# Altium schematic sheet CR-10 Motherboard_1.SchDoc: Sheet Description
size A3; Organization: Organization; Address1: Address1; Address2: Address2; Address3: Address3; Address4: Address4; DocumentNumber: 1; Revision: 0; SheetNumber: 1; SheetTotal: 2; PageSetup: Record=PageOptions|CenterHorizontal=True|CenterVertical=True|PrintScale=1.00|XCorrection=1.00|YCorrection=1.00|PrintKind=1|BorderSize=5000000|LeftOffset=0|BottomOffset=0|Orientation=2|PaperLength=1000|PaperWidth=1000|Scale=100|PaperSource=7|PrintQuality=-4|MediaType=1|DitherType=10|PaperKind=A3|PrintScaleMode=0
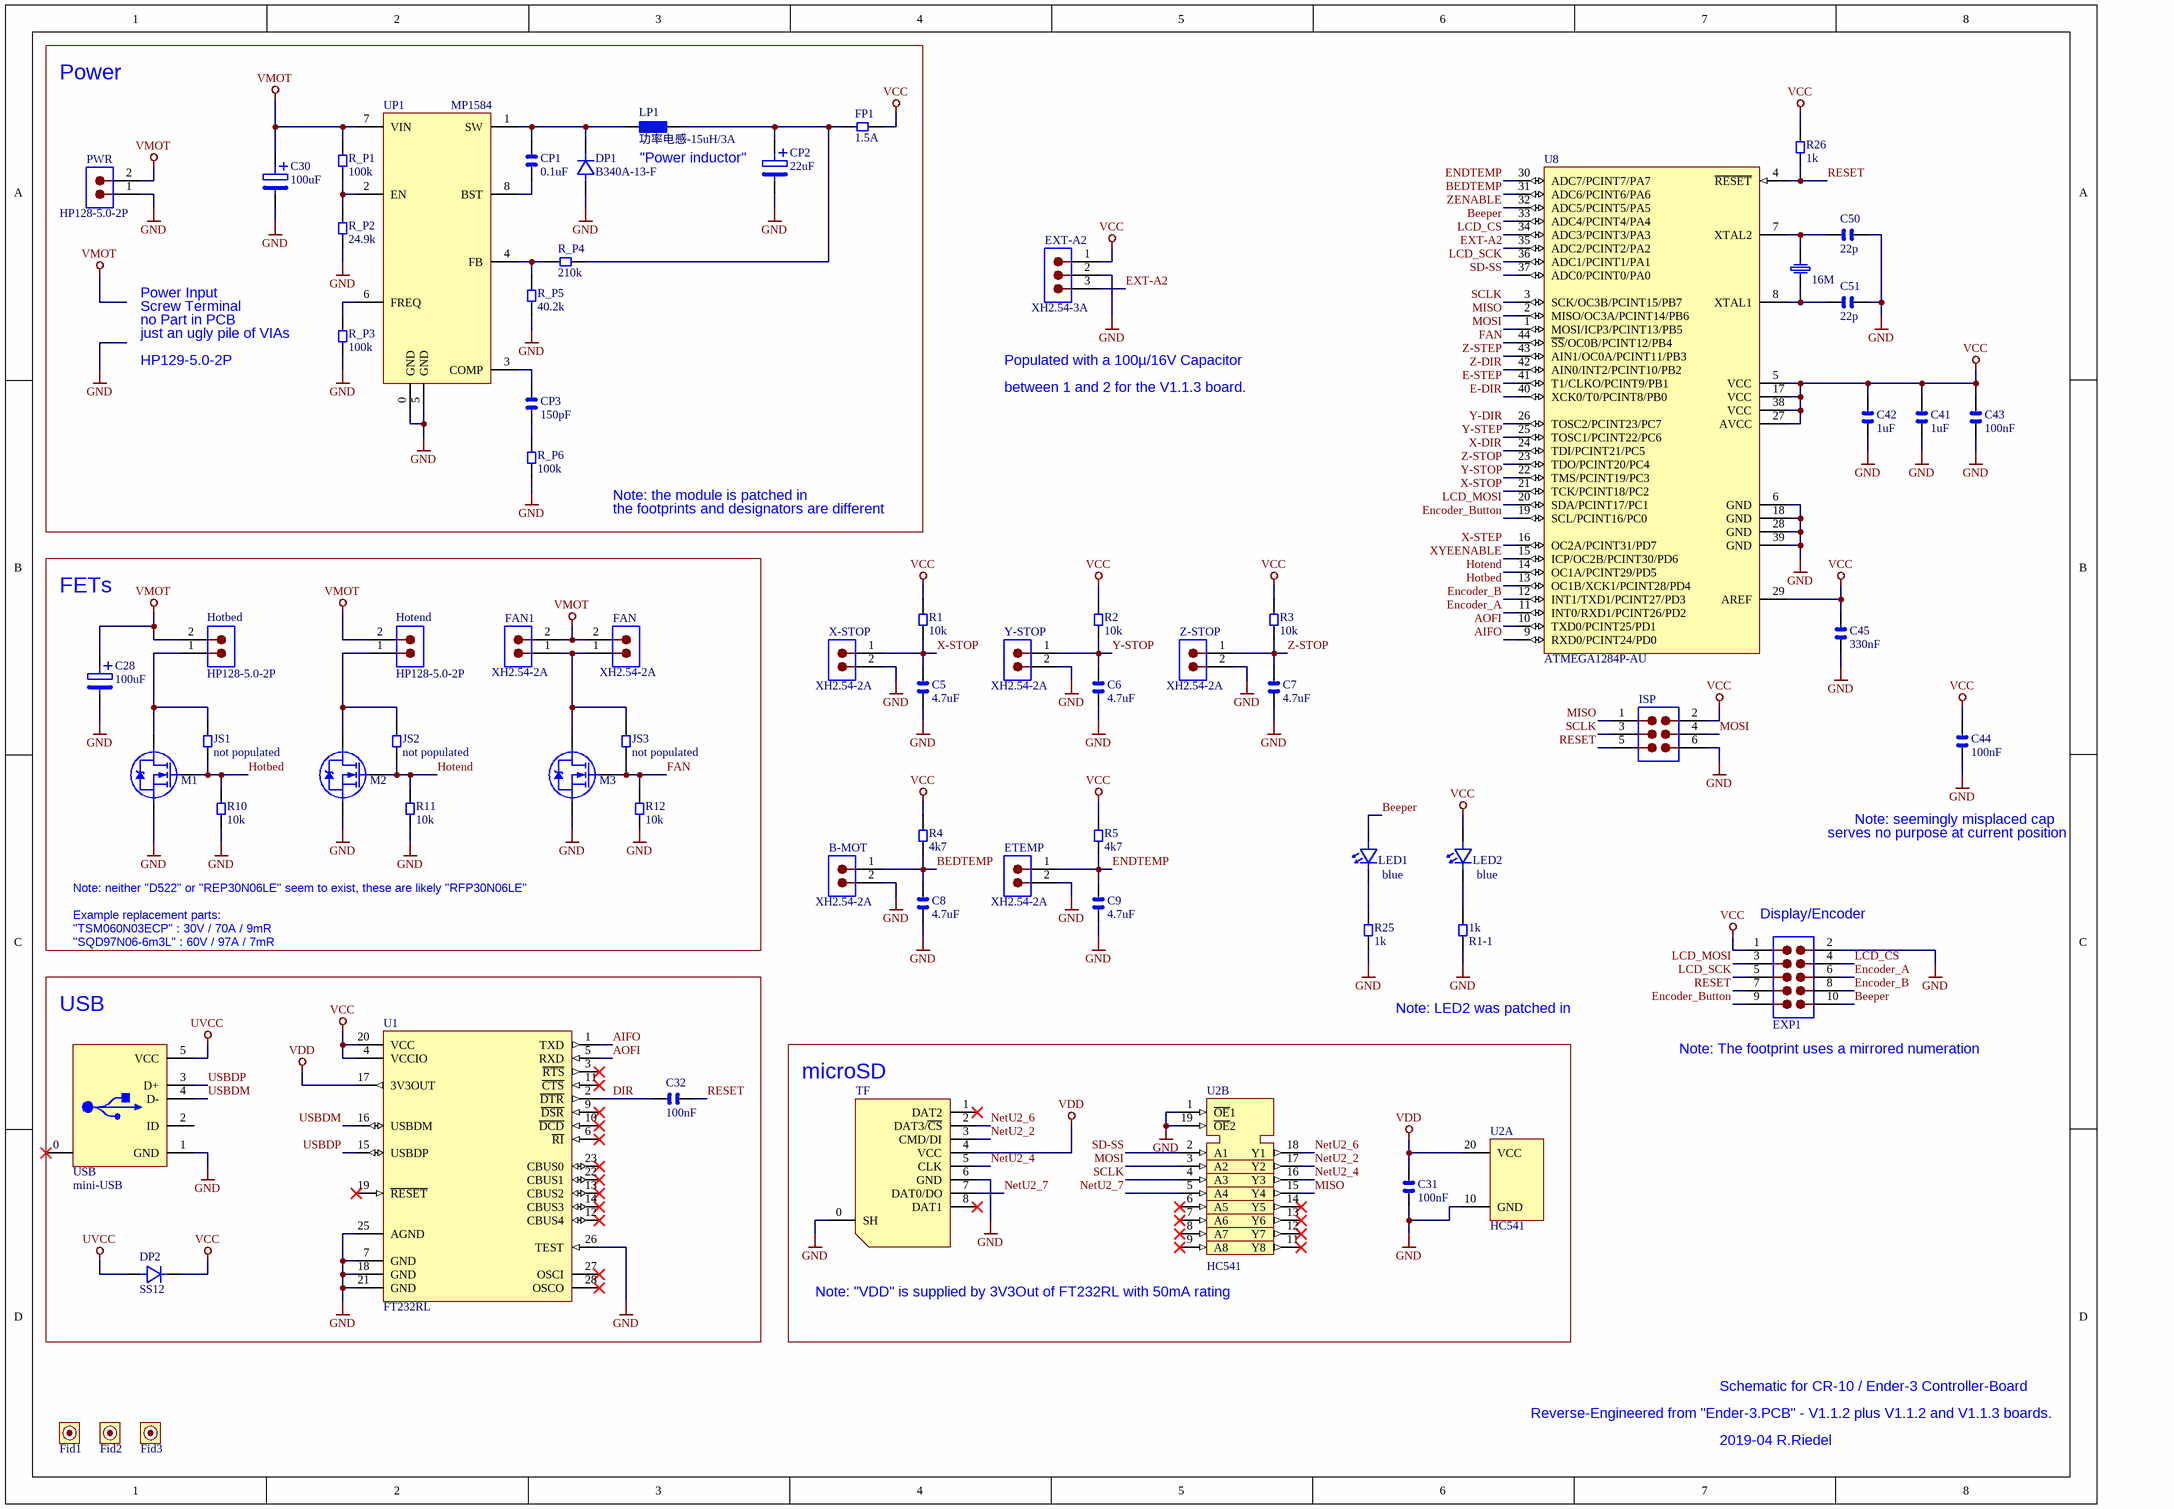
[diagram p0: CR-10 Motherboard_1.SchDoc]

## Parts
1k  R1-1  [0603]
16M  16Mhz  [CRY]  (value not drawn)
B-MOT  XH2.54-2A  [P2]
C5  4.7uF  [0805]
C6  4.7uF  [0805]
C7  4.7uF  [0805]
C8  4.7uF  [0805]
C9  4.7uF  [0805]
C28  100uF  [CAP-100]
C30  100uF  [CAP-100]
C31  100nF  [0805]
C32  100nF  [0603]
C41  1uF  [0603]
C42  1uF  [0603]
C43  100nF  [0603]
C44  100nF  [0603]
C45  330nF  [0603]
C50  22p  [0603]
C51  22p  [0603]
CP1  0.1uF  [C0603]
CP2  22uF  [RVT4X5.5]
CP3  150pF  [C0603]
DP1  B340A-13-F  [D-SMA]
DP2  SS12  [D-SMA]
ETEMP  XH2.54-2A  [P2]
EXP1  Header 2x5  [SOP10]  (value not drawn)
EXT-A2  XH2.54-3A  [XH-3A]
FAN  XH2.54-2A  [P2]
FAN1  XH2.54-2A  [P2]
Fid1  Fiducial  [Fiducial-A]  (value not drawn)
Fid2  Fiducial  [Fiducial-A]  (value not drawn)
Fid3  Fiducial  [Fiducial-A]  (value not drawn)
FP1  1.5A  [MF-MSMF050]
Hotbed  HP128-5.0-2P  [MOT-2]
Hotend  HP128-5.0-2P  [MOT-2]
ISP  HEADER 3X2  (value not drawn)
JS1  not populated  [R10]
JS2  not populated  [R10]
JS3  not populated  [R10]
LED1  blue  [0603]
LED2  blue  [0603]
LP1  功率电感-15uH/3A  [DO3316P]
M1  REP30N06LE  [TO-252]  (value not drawn)
M2  REP30N06LE  [TO-252]  (value not drawn)
M3  REP30N06LE  [TO-252]  (value not drawn)
PWR  HP128-5.0-2P  [MOT-2]
R1  10k  [0603]
R2  10k  [0603]
R3  10k  [0603]
R4  4k7  [0603]
R5  4k7  [0603]
R10  10k  [0603]
R11  10k  [0603]
R12  10k  [0603]
R25  1k  [0603]
R26  1k  [0603]
R_P1  100k  [R0603]
R_P2  24.9k  [R0603]
R_P3  100k  [R0603]
R_P4  210k  [R0603]
R_P5  40.2k  [R0603]
R_P6  100k  [R0603]
TF  TF  [TF]  (value not drawn)
U1  FT232RL  [PL2303]
U2  HC541  [SSOP-20]  (parts A,B of 2)
U8  ATMEGA1284P-AU  [QFP-44]
UP1  MP1584  [SOIC8E]
USB  mini-USB  [USB]
X-STOP  XH2.54-2A  [P2]
Y-STOP  XH2.54-2A  [P2]
Z-STOP  XH2.54-2A  [P2]

## Blocks framed on the sheet
Power: C30 CP1-CP3 DP1 FP1 LP1 PWR R_P1-R_P6 UP1
FETs: C28 FAN FAN1 Hotbed Hotend JS1-JS3 M1-M3 R10-R12
USB: C32 DP2 U1 USB
microSD: C31 TF U2

## Nets
GND: 1k.2 B-MOT.2 C5.2 C6.2 C7.2 C8.2 C9.2 C28.2 C30.2 C31.2 C41.2 C42.2 C43.2 C44.2 C45.2 C50.2 C51.2 CP2.2 DP1.1 ETEMP.2 EXP1.2 EXT-A2.2 ISP.6 M1.3(S) M2.3(S) M3.3(S) PWR.1 R10.2 R11.2 R12.2 R25.2 R_P2.2 R_P3.2 R_P5.2 R_P6.2 TF.0(SH) TF.6(GND) U1.7(GND) U1.18(GND) U1.21(GND) U1.25(AGND) U1.26(TEST) U2.1(~{OE}1) U2.10(GND) U2.19(~{OE}2) U8.6(GND) U8.18(GND) U8.28(GND) U8.39(GND) UP1.0(GND) UP1.5(GND) USB.1(GND) X-STOP.2 Y-STOP.2 Z-STOP.2
UVCC: DP2.1 USB.5(VCC)
VCC: C41.1 C42.1 C43.1 C44.1 C45.1 DP2.2 EXP1.1 EXT-A2.1 FP1.2 ISP.2 LED2.2 R1.2 R2.2 R3.2 R4.2 R5.2 R26.2 U1.4(VCCIO) U1.20(VCC) U8.5(VCC) U8.17(VCC) U8.27(AVCC) U8.29(AREF) U8.38(VCC)
VDD: C31.1 TF.4(VCC) U1.17(3V3OUT) U2.20(VCC)
VMOT: C28.1 C30.1 FAN.2 FAN1.2 Hotbed.2 Hotend.2 PWR.2 R_P1.1 UP1.7(VIN)
AIFO: U1.1(TXD) U8.9(RXD0/PCINT24/PD0)
AOFI: U1.5(RXD) U8.10(TXD0/PCINT25/PD1)
BEDTEMP: B-MOT.1 C8.1 R4.1 U8.31(ADC6/PCINT6/PA6)
Beeper: EXP1.10 LED1.1 U8.33(ADC4/PCINT4/PA4)
DIR: C32.1 U1.2(~{DTR})
E-DIR: U8.40(XCK0/T0/PCINT8/PB0)
E-STEP: U8.41(T1/CLKO/PCINT9/PB1)
Encoder_A: EXP1.6 U8.11(INT0/RXD1/PCINT26/PD2)
Encoder_B: EXP1.8 U8.12(INT1/TXD1/PCINT27/PD3)
Encoder_Button: EXP1.9 U8.19(SCL/PCINT16/PC0)
ENDTEMP: C9.1 ETEMP.1 R5.1 U8.30(ADC7/PCINT7/PA7)
EXT-A2: EXT-A2.3 U8.35(ADC2/PCINT2/PA2)
FAN: JS3.1 M3.1(G) R12.1 U8.44(~{SS}/OC0B/PCINT12/PB4)
Hotbed: JS1.1 M1.1(G) R10.1 U8.13(OC1B/XCK1/PCINT28/PD4)
Hotend: JS2.1 M2.1(G) R11.1 U8.14(OC1A/PCINT29/PD5)
LCD_CS: EXP1.4 U8.34(ADC3/PCINT3/PA3)
LCD_MOSI: EXP1.3 U8.20(SDA/PCINT17/PC1)
LCD_SCK: EXP1.5 U8.36(ADC1/PCINT1/PA1)
MISO: ISP.1 U2.15(Y4) U8.2(MISO/OC3A/PCINT14/PB6)
MOSI: ISP.4 U2.3(A2) U8.1(MOSI/ICP3/PCINT13/PB5)
NetU2_2: TF.3(CMD/DI) U2.17(Y2)
NetU2_4: TF.5(CLK) U2.16(Y3)
NetU2_6: TF.2(DAT3/~{CS}) U2.18(Y1)
NetU2_7: TF.7(DAT0/DO) U2.5(A4)
RESET: C32.2 EXP1.7 ISP.5 R26.1 U8.4(~{RESET})
SCLK: ISP.3 U2.4(A3) U8.3(SCK/OC3B/PCINT15/PB7)
SD-SS: U2.2(A1) U8.37(ADC0/PCINT0/PA0)
USBDM: U1.16(USBDM) USB.4(D-)
USBDP: U1.15(USBDP) USB.3(D+)
X-DIR: U8.24(TDI/PCINT21/PC5)
X-STEP: U8.16(OC2A/PCINT31/PD7)
X-STOP: C5.1 R1.1 U8.21(TCK/PCINT18/PC2) X-STOP.1
XYEENABLE: U8.15(ICP/OC2B/PCINT30/PD6)
Y-DIR: U8.26(TOSC2/PCINT23/PC7)
Y-STEP: U8.25(TOSC1/PCINT22/PC6)
Y-STOP: C6.1 R2.1 U8.22(TMS/PCINT19/PC3) Y-STOP.1
Z-DIR: U8.42(AIN0/INT2/PCINT10/PB2)
Z-STEP: U8.43(AIN1/OC0A/PCINT11/PB3)
Z-STOP: C7.1 R3.1 U8.23(TDO/PCINT20/PC4) Z-STOP.1
ZENABLE: U8.32(ADC5/PCINT5/PA5)
Net1k_1: 1k.1 LED2.1
Net16M_1: 16M.1 C50.1 U8.7(XTAL2)
Net16M_2: 16M.2 C51.1 U8.8(XTAL1)
NetCP1_1: CP1.1 UP1.8(BST)
NetCP1_2: CP1.2 DP1.2 LP1.2 UP1.1(SW)
NetCP2_1: CP2.1 FP1.1 LP1.1 R_P4.2
NetCP3_1: CP3.1 R_P6.1
NetCP3_2: CP3.2 UP1.3(COMP)
NetFAN_1: FAN.1 FAN1.1 JS3.2 M3.2(D)
NetHotbed_1: Hotbed.1 JS1.2 M1.2(D)
NetHotend_1: Hotend.1 JS2.2 M2.2(D)
NetLED1_2: LED1.2 R25.1
NetR_P1_2: R_P1.2 R_P2.1 UP1.2(EN)
NetR_P3_1: R_P3.1 UP1.6(FREQ)
NetR_P4_1: R_P4.1 R_P5.1 UP1.4(FB)

Not connected (* = marked no-connect by the designer): TF 1(DAT2)* 8(DAT1)*; U1 3(~{RTS})* 6(~{RI})* 9(~{DSR})* 10(~{DCD})* 11(~{CTS})* 12(CBUS4)* 13(CBUS2)* 14(CBUS3)* 19(~{RESET})* 22(CBUS1)* 23(CBUS0)* 27(OSCI)* 28(OSCO)*; U2 6(A5)* 7(A6)* 8(A7)* 9(A8)* 11(Y8)* 12(Y7)* 13(Y6)* 14(Y5)*; USB 0(SH)* 2(ID)

## Notes on the sheet
- "Power inductor"
- Screw Terminal
- Power Input
- no Part in PCB
- (near R_P3) just an ugly pile of VIAs
- HP129-5.0-2P
- Populated with a 100µ/16V Capacitor
- between 1 and 2 for the V1.1.3 board.
- Note: the module is patched in
- the footprints and designators are different
- serves no purpose at current position
- Note: seemingly misplaced cap
- Note: neither "D522" or "REP30N06LE" seem to exist, these are likely "RFP30N06LE"
- Example replacement parts:
- (near EXP1) Display/Encoder
- "TSM060N03ECP" : 30V / 70A / 9mR
- "SQD97N06-6m3L" : 60V / 97A / 7mR
- Note: LED2 was patched in
- (near EXP1) Note: The footprint uses a mirrored numeration
- (near U2) Note: "VDD" is supplied by 3V3Out of FT232RL with 50mA rating
- Schematic for CR-10 / Ender-3 Controller-Board
- Reverse-Engineered from "Ender-3.PCB" - V1.1.2 plus V1.1.2 and V1.1.3 boards.
- 2019-04 R.Riedel

## Library data of the parts
1k JS1-JS3 R10-R12 R25 R26 R_P1 R_P3-R_P6 = Resistor: 0603 Chip Resistor
16M = Crystal: Crystal HC49/US
B-MOT ETEMP FAN FAN1 X-STOP Y-STOP Z-STOP = Header 1x2
C5-C9 = CAP_2_V2: 0805 Chip Capacitor
C28 C30 CP2 = Capacitor Pol: Capacitor Polarized
C31 C32 C41-C45 C50 C51 = Capacitor: 0805 Chip Capacitor
CP1 CP3 = Capacitor: Chip Capacitor
DP1 DP2 = Diode_A1_K2: Diode
EXT-A2 = Header 1x3
FP1 R_P2 = Resistor: Chip Resistor
Hotbed Hotend PWR = Header 1x2: Terminal 1x2
ISP = Header 2x3
LED1 = LED_A1C2: LED
LED2 = LED_C1A2: LED
LP1 = Inductor
M1-M3 = N-FET
R1-R5 = RES_2_V2: 0603 Chip Resistor
TF = microSD
U1 = FT232RL: FTDI USB UART I.C.
U2 = 74HC541: 74HC541 - Octal buffer/line driver
U8 = ATmegaxx4PA-xx: AVR 8-Bit, 128k FLASH, TQFP44; Part Number: ATmega1284P-AU; PackageDescription: TQFP44
USB = USB